# Altium schematic sheet IMU.SchDoc
size A2
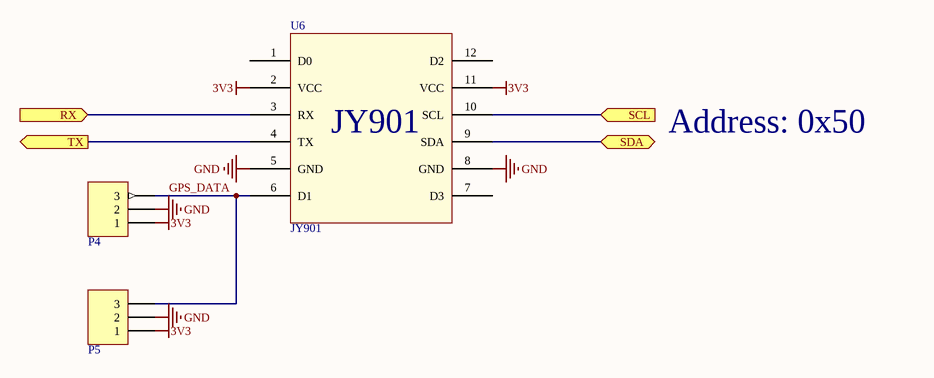
[diagram p0: IMU.SchDoc]

## Parts
P4  0.1" 3POS Header SNGL  [3 POS HEADER SINGLE ROW]  (value not drawn)
P5  B3B-PH-SM4-TB(LF)(SN)  [B3B-PH-SM4-TB(LF)(SN)]  (value not drawn)
U6  JY901  [JY-901]

## Ports
RX (in), SCL (in), SDA (bidir), TX (out)

## Nets
3V3: P4.1 P5.1 U6.2(VCC) U6.11(VCC)
GND: P4.2 P5.2 U6.5(GND) U6.8(GND)
GPS_DATA: P4.3 P5.3 U6.6(D1)
RX: U6.3(RX) ; port RX
SCL: U6.10(SCL) ; port SCL
SDA: U6.9(SDA) ; port SDA
TX: U6.4(TX) ; port TX

Not connected (* = marked no-connect by the designer): U6 1(D0) 7(D3) 12(D2)

## Notes on the sheet
- Address: 0x50

## Library data of the parts
P4 = CONN HEADER 3POS .100" SNGL TIN: Manufacturer: Samtec Inc; Manufacturer Part Number: TSW-150-08-T-S; Unit Price in Quantity: 1.0189; Part Number: CONN HEADER 3POS .100" SNGL TIN; Mounting Type: thru-hole; Package: header; Component Type: Standard; Pin Count: 3; Supplier 1: Digikey; Supplier 1 Part Number: SAM1050-50-ND; Unit Price-Supplier 1: 2.24; Price Break: 1000; Vendor/Distributor: Digikey
P5 = CONN HEADER PH TOP 3POS 2MM SMD: Manufacturer: JST Sales America Inc.; Unit Price in Quantity: .2972; Part Number: CONN HEADER PH TOP 3POS 2MM SMD; Mounting Type: SMD; Package: header; Component Type: Standard; Pin Count: 3; Manufacturer Part Number: B3B-PH-SM4-TB(LF)(SN); Supplier 1: Digikey; Supplier 1 Part Number: 455-1735-1-ND; Unit Price-Supplier 1: .63; Price Break: 1000; Vendor/Distributor: Digikey